# EAGLE design IR Transmitter (EAGLE 7.6.0)
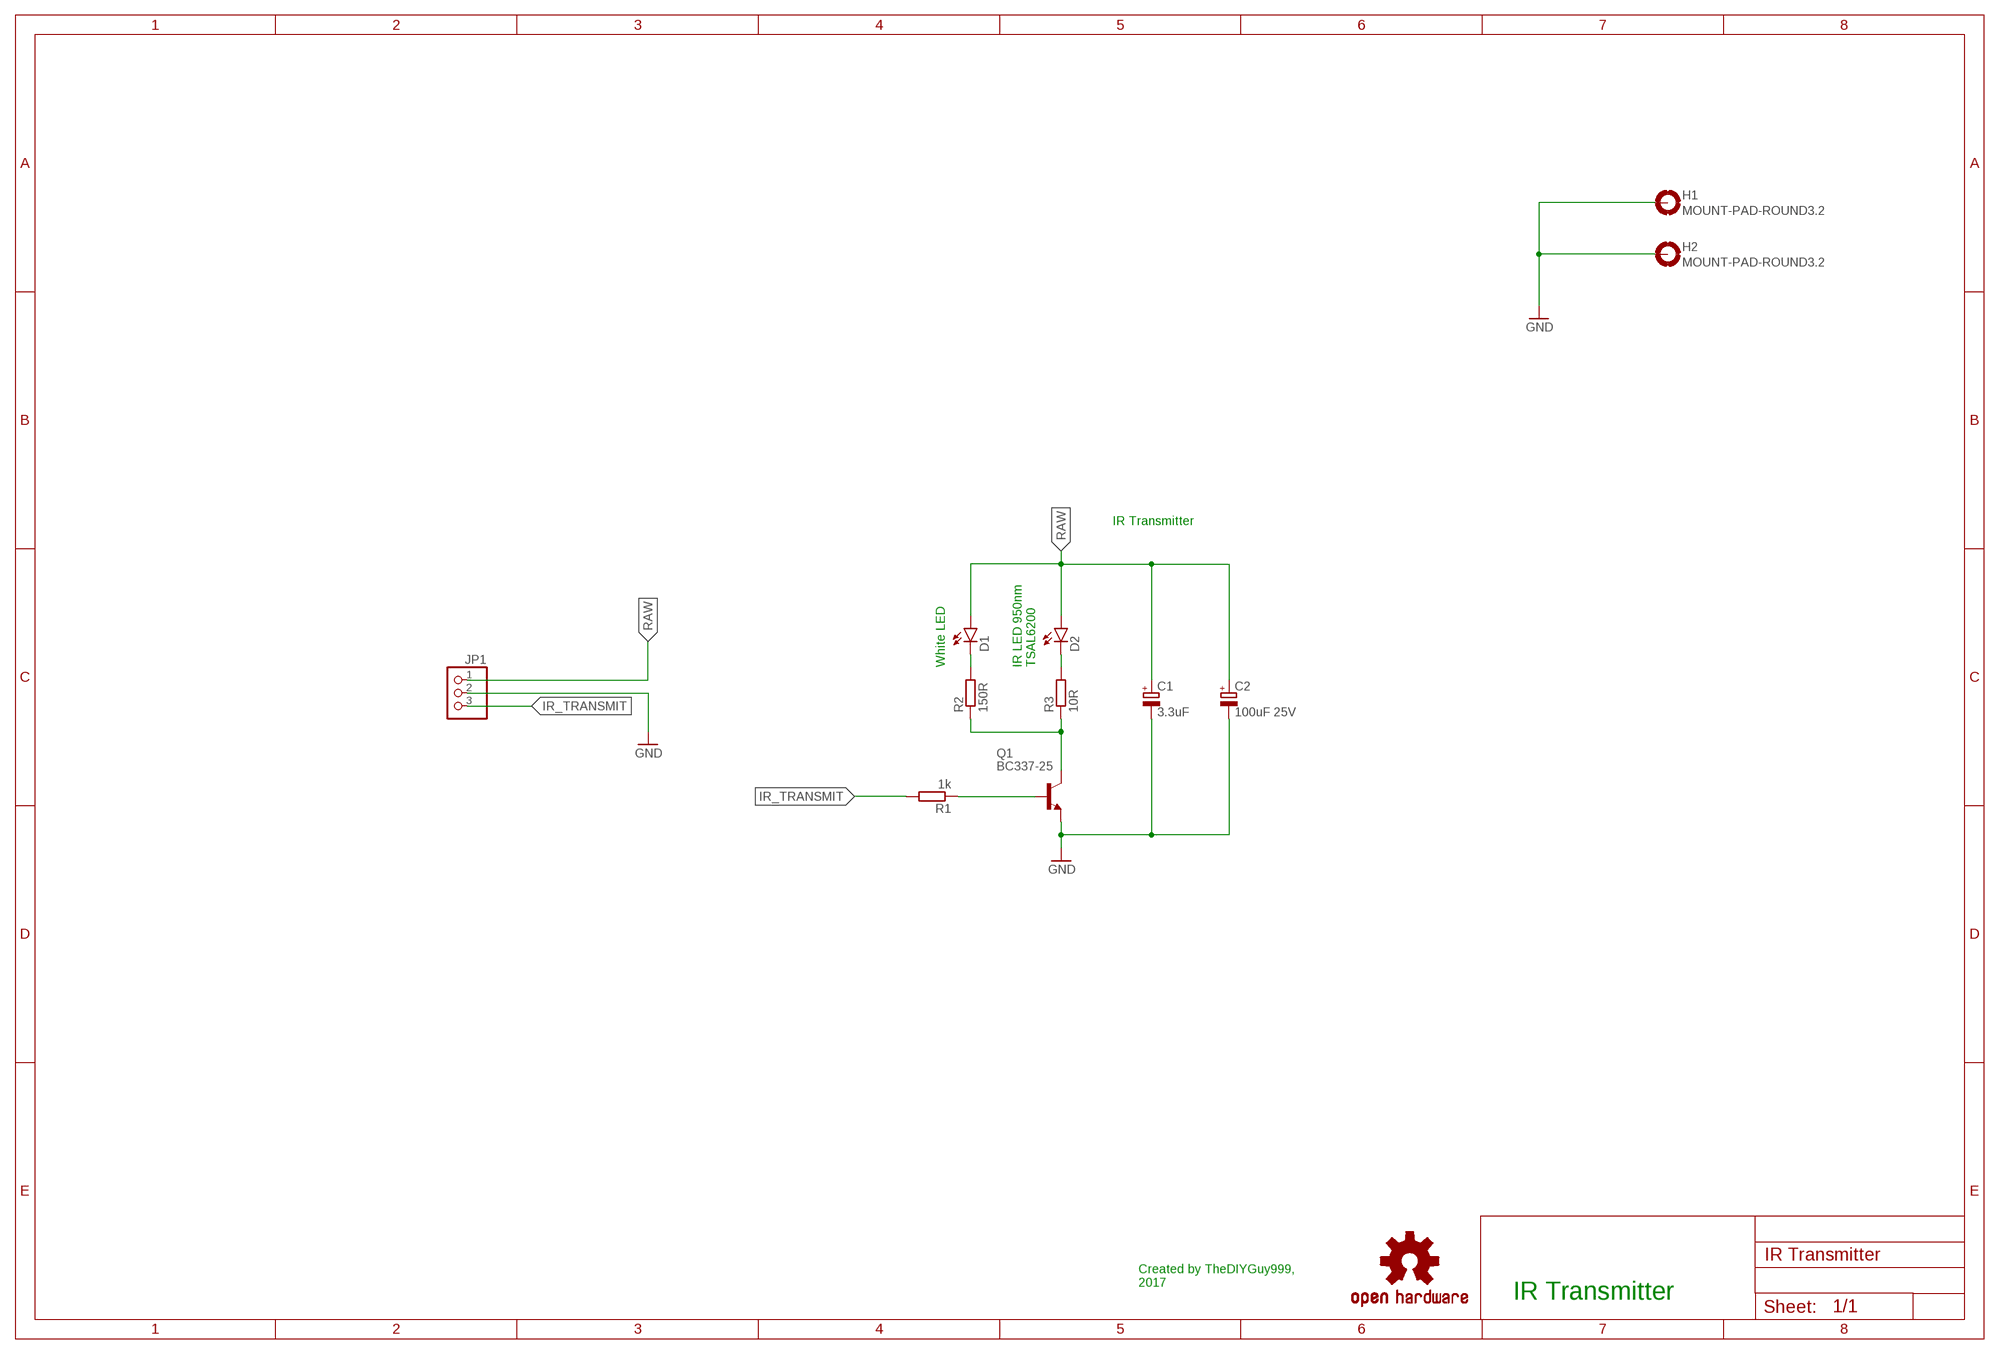
[diagram p0: schematic, sheet 1]

## Parts
C1  3.3uF  CPOL-EUB45181A  [B45181A]
C2  100uF 25V  CPOL-EUE2.5-7  [E2,5-7]
D1  LED5MM  [LED5MM]
D2  LED5MM  [LED5MM]
H1  MOUNT-PAD-ROUND3.2  [3,2-PAD]
H2  MOUNT-PAD-ROUND3.2  [3,2-PAD]
JP1  PINHD-1X3  [1X03]
LOGO1  OSHW-LOGOM  [OSHW-LOGO-M]
Q1  BC337-25  [TO92]
R1  1k  R-EU_0207/2V  [0207/2V]
R2  150R  R-EU_0207/2V  [0207/2V]
R3  10R  R-EU_0207/2V  [0207/2V]

## Nets
GND: C1.- C2.- H1.B3,2(MOUNT) H2.B3,2(MOUNT) JP1.2 Q1.1(E)
IR_TRANSMIT: JP1.3 R1.2
N$3: Q1.3(C) R2.1 R3.1
N$4: D2.K(C) R3.2
N$5: Q1.2(B) R1.1
N$6: D1.K(C) R2.2
RAW: C1.+ C2.+ D1.A D2.A JP1.1

## Notes on the sheet
- IR Transmitter
- White LED
- IR LED 950nm
  TSAL6200
- Created by TheDIYGuy999,
  2017
- IR Transmitter

## Library data of the parts
C1 C2 = rcl:CPOL-EU: POLARIZED CAPACITOR, European symbol
D1 D2 = SparkFun-LED:LED: LEDs Standard schematic elements and footprints for 5mm, 3mm, 1206, and 0603 sized LEDs. 5mm - Spark Fun Electronics SKU : COM-00529 (and others)
H1 H2 = holes:MOUNT-PAD-ROUND: MOUNTING PAD, round
JP1 = pinhead:PINHD-1X3: PIN HEADER
LOGO1 = SparkFun-Aesthetics:OSHW-LOGO: Open Source Hardware Logo This logo indicates the piece of hardware it is found on incorporates a OSHW license and/or adheres to the definition of open source hardware found here: http://freedomdefined.org/OSHW
Q1 = transistor-npn:BC337*: NPN Transistor
R1-R3 = rcl:R-EU_: RESISTOR, European symbol

## Board
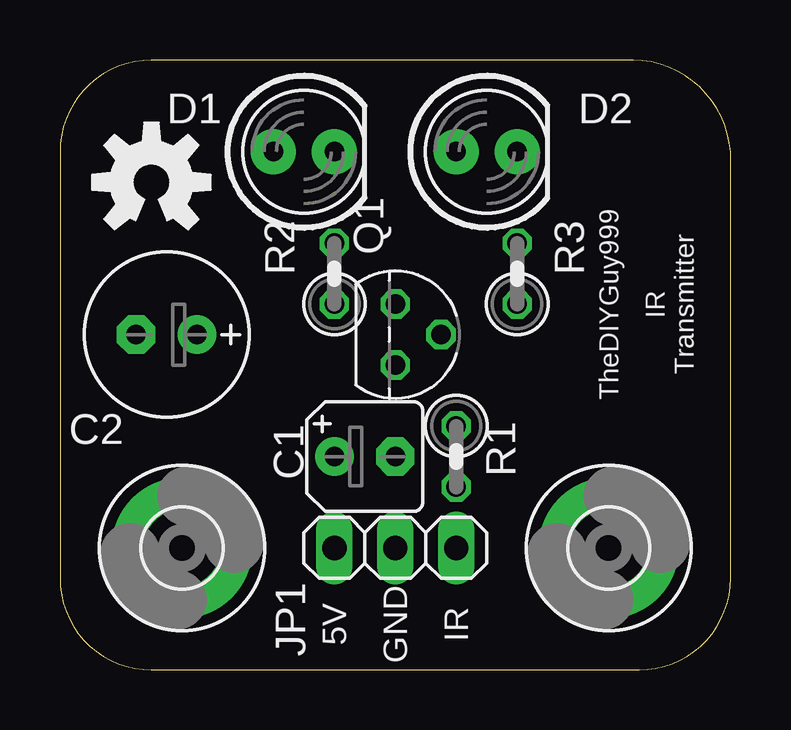
[diagram p1: board, top side]
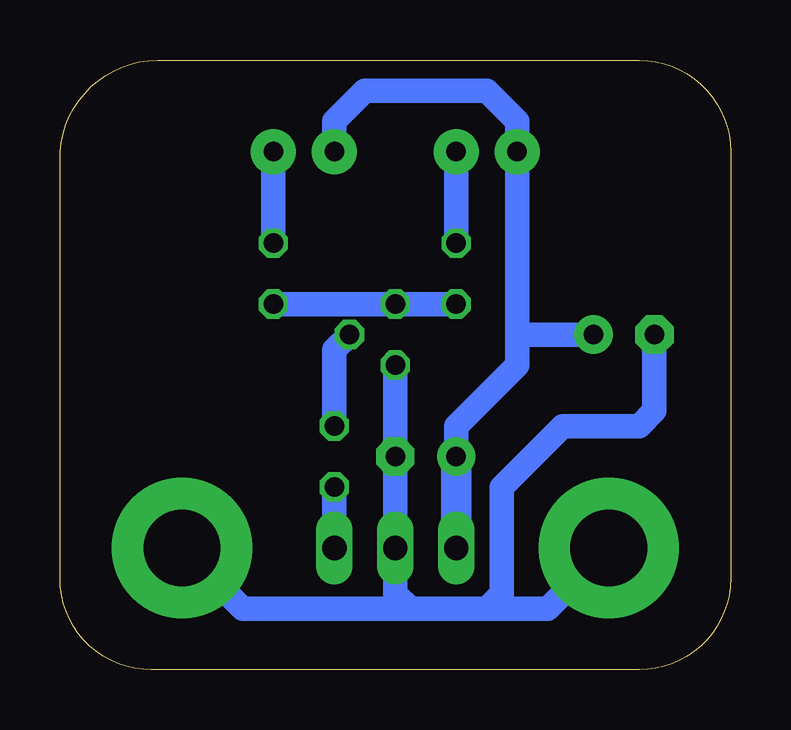
[diagram p2: board, bottom side, seen from below]

Size 27.94 x 25.41 mm. Coordinates in mm from the lower left corner, seen from the top.
Outline: 0,21.59 0,3.81 arc90 3.81,0 24.13,0 arc90 27.94,3.81 27.94,21.59 arc90 23.5,25.4 3.81,25.4 arc90 0,21.59
Copper layers (1*16): Top 0.0356mm / dielectric 1.5011mm / Bottom 0.0356mm
Design rules "OSHPark_LaenPCBOrder": minimum track width 6mil, minimum drill 13mil, track to track 6mil, track to pad 6mil, pad to pad 6mil, via to via 6mil, smd to smd 6mil, copper to edge 15mil, drill to drill 6mil, minimum pad ring 7mil, minimum via ring 7mil, stop-mask expansion 3mil, vias tented up to drill 0mil, thermal gap 10mil

### Footprints (pad centres in the part's own frame; a part is rotated, then mirrored left to right if it is on the bottom)
B45181A = drill 0.813 pad 1.6: + -1.27,0 | drill 0.813 pad 1.6 octagon: - 1.27,0
E2,5-7 = drill 0.813 pad 1.6: + -1.27,0 | drill 0.813 pad 1.6 octagon: - 1.27,0
LED5MM = drill 0.813 pad 1.88: A -1.27,0; K 1.27,0
3,2-PAD = drill 3.2 pad 5.842: B3,2 0,0
1X03 = drill 1.016 long: 1 -2.54,0; 2 0,0; 3 2.54,0
TO92 = drill 0.813 octagon: 1 1.27,0; 2 0,1.905; 3 -1.27,0
0207/2V = drill 0.813 octagon: 1 -1.27,0; 2 1.27,0

### Placement (x,y rotation side)
C1  12.7,8.89 0 top
C2  4.45,13.97 180 top
D1  10.16,21.59 0 top
D2  17.78,21.59 0 top
H1  22.86,5.08 0 top
H2  5.08,5.08 0 top
JP1  13.97,5.08 0 top
LOGO1  3.81,20.32 0 top
Q1  13.97,13.97 270 top
R1  16.51,8.89 270 top
R2  11.43,16.51 90 top
R3  19.05,16.51 90 top

### Tracks (layer width: path | path; a pad name or v marks a point on that pad's centre or on a via)
GND
  Bottom 1.016: Q1.1 C1.- JP1.2 13.97,3.17 13.34,2.54 | C2.- 3.17,10.79 3.81,10.16 6.99,10.16 9.53,7.62 9.53,3.17 10.16,2.54 | 10.16,2.54 12.7,2.54 13.34,2.54 | H2.B3,2 7.62,2.54 10.16,2.54 | H1.B3,2 20.32,2.54 13.34,2.54
IR_TRANSMIT
  Bottom 1.016: R1.2 JP1.3
N$3
  Bottom 1.016: R3.1 Q1.3 R2.1
N$4
  Bottom 1.016: R3.2 D2.K
N$5
  Bottom 1.016: R1.1 16.51,13.34 Q1.2
N$6
  Bottom 1.016: R2.2 D1.K
RAW
  Bottom 1.016: C1.+ 11.43,10.16 8.89,12.7 8.89,13.97 | 8.89,13.97 D1.A 8.89,22.86 10.16,24.13 15.24,24.13 16.51,22.86 D2.A | C2.+ 8.89,13.97
  Bottom 1.27: C1.+ JP1.1

### Text on the board
tNames: TheDIYGuy999 | IR / Transmitter | 5V | GND | IR